# Altium schematic sheet Main.SchDoc
size A; SheetNumber: 1; SheetTotal: 1
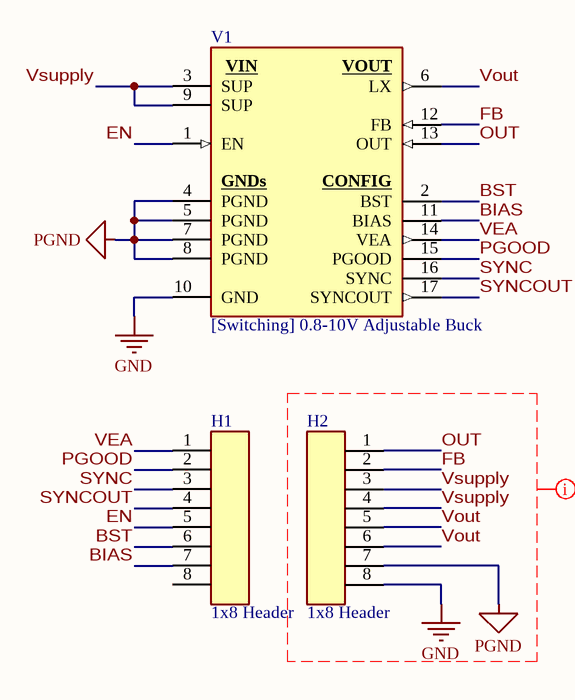
[diagram p0: Main.SchDoc]

## Parts
H1  1x8 Header  [[Header] 1x8 Male]
H2  1x8 Header  [[Header] 1x8 Male]
V1  [Switching] 0.8-10V Adjustable Buck  [[Switching] 0.8-10V Adjustable Buck]

## Nets
GND: H2.8 V1.10(GND)
PGND: H2.7 V1.4(PGND) V1.5(PGND) V1.7(PGND) V1.8(PGND)
BIAS: H1.7 V1.11(BIAS)
BST: H1.6 V1.2(BST)
EN: H1.5 V1.1(EN)
FB: H2.2 V1.12(FB)
OUT: H2.1 V1.13(OUT)
PGOOD: H1.2 V1.15(PGOOD)
SYNC: H1.3 V1.16(SYNC)
SYNCOUT: H1.4 V1.17(SYNCOUT)
VEA: H1.1 V1.14(VEA)
Vout: H2.5 H2.6 V1.6(LX)
Vsupply: H2.3 H2.4 V1.3(SUP) V1.9(SUP)

Not connected (* = marked no-connect by the designer): H1 8

## Layout directives
net class Supply_Nets: FB, GND, OUT, PGND, Vout, Vsupply

## Notes on the sheet
- (in symbol [Switching] 0.8-10V Adjustable Buck) VIN; VOUT; GNDs; CONFIG

## Library data of the parts
H1 H2 = [Header] 1x8 Male: 2.54mm pitch
V1 = [Switching] 0.8-10V Adjustable Buck: MAX20408AFOF/VY+; Supplier 1: DigiKey; Supplier Part Number 1: 505-MAX20408AFOF/VY+-ND